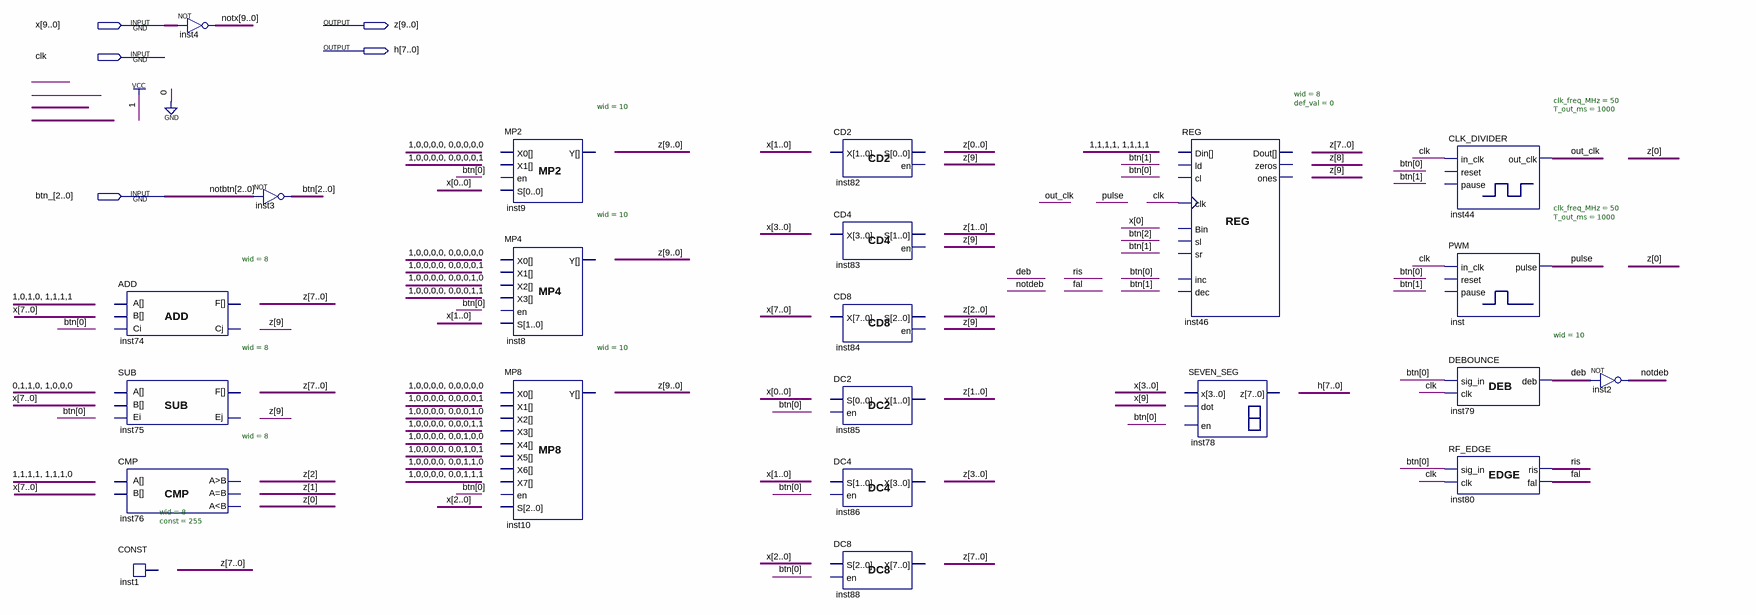
[diagram p0: schematic sheet]
// Quartus schematic test.bdf as structural Verilog: 22 symbols, 5 pins
module test (
  input  [9:0] x,
  input  clk,
  input  [2:0] btn_,
  output [9:0] z,
  output [7:0] h
);

  wire deb, fal, notdeb, out_clk, pulse, ris;
  wire [2:0] btn;
  wire [9:0] notx;

  ADD #(.wid(8)) inst74 ();  // open: A, B, Ci, F, Cj
  SUB #(.wid(8)) inst75 ();  // open: A, B, Ei, F, Ej
  CMP #(.wid(8)) inst76 ();  // open: A, B, gr, eq, ls
  CONST #(.wid(8), .\const (255)) inst1 ();  // open: data
  assign notx = ~x;  // NOT inst4, 10 bits wide
  assign btn = ~btn_;  // NOT inst3, 3 bits wide
  MP2 #(.wid(10)) inst9 ();  // open: X0, X1, en, S, Y
  MP4 #(.wid(10)) inst8 ();  // open: X0, X1, X2, X3, en, S, Y
  MP8 #(.wid(10)) inst10 ();  // open: X0, X1, X2, X3, X4, X5, X6, X7, en, S, Y
  CD2 inst82 ();  // open: X, S, en
  CD4 inst83 ();  // open: X, S, en
  CD8 inst84 ();  // open: X, S, en
  DC2 inst85 ();  // open: S, en, X
  DC4 inst86 ();  // open: S, en, X
  DC8 inst88 ();  // open: S, en, X
  REG #(.wid(8), .def_val(0)) inst46 (.clk(clk));  // open: ld, cl, Bin, sl, sr, inc, dec, Din, Dout, zeros, ones
  SEVEN_SEG inst78 ();  // open: x, dot, en, z
  CLK_DIVIDER #(.clk_freq_MHz(50), .T_out_ms(1000)) inst44 (.in_clk(clk), .out_clk(out_clk));  // open: reset, pause
  PWM #(.clk_freq_MHz(50), .T_out_ms(1000)) inst (.in_clk(clk), .pulse(pulse));  // open: reset, pause
  DEBOUNCE #(.wid(10)) inst79 (.sig_in(btn[0]), .clk(clk), .deb(deb));
  RF_EDGE inst80 (.sig_in(btn[0]), .clk(clk), .ris(ris), .fal(fal));
  not inst2 (notdeb, deb);

  // Other names for the same wires on the sheet: notbtn[2:0] = btn_
endmodule
